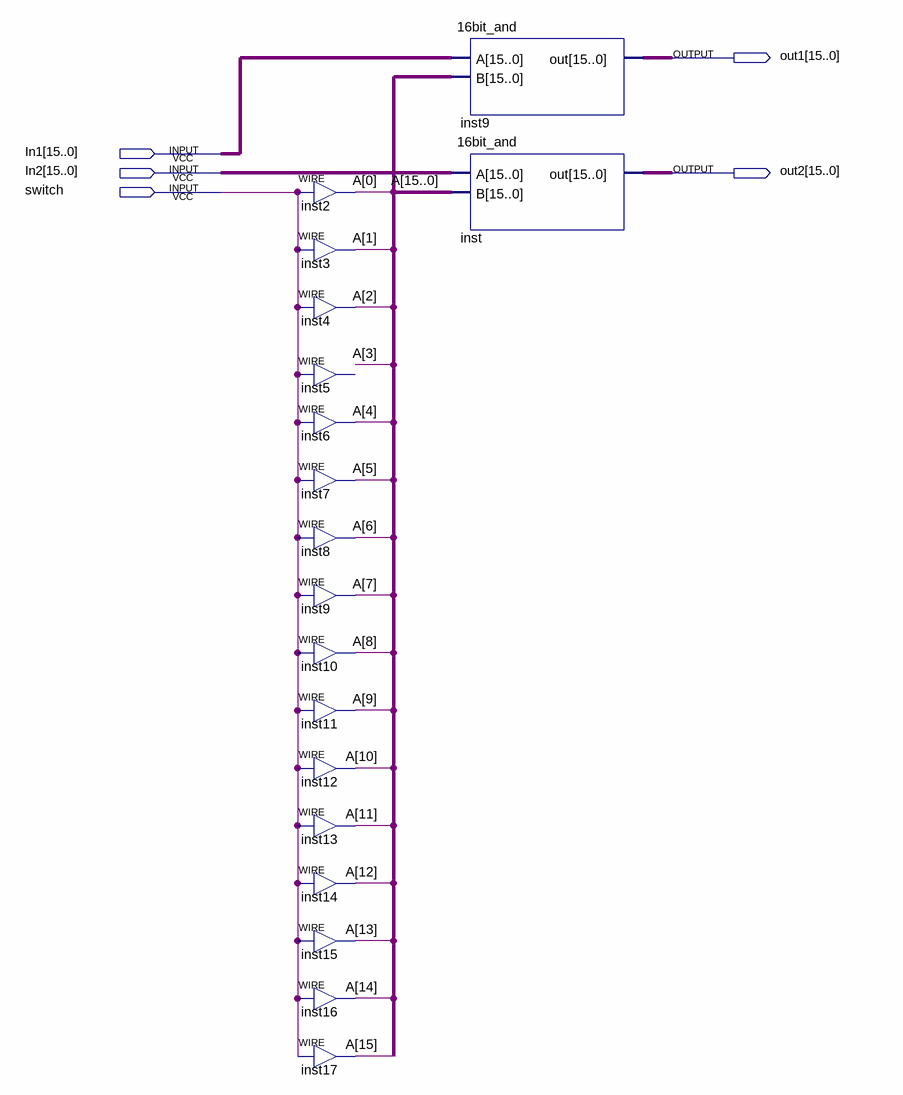
[diagram p0: schematic sheet]
// Quartus schematic celectgate.bdf as structural Verilog: 18 symbols, 5 pins
module celectgate (
  input  [15:0] In1,
  input  [15:0] In2,
  input  switch,
  output [15:0] out1,
  output [15:0] out2
);

  wire [15:0] A;

  assign A[0] = switch;  // WIRE inst2
  assign A[1] = switch;  // WIRE inst3
  assign A[2] = switch;  // WIRE inst4
  // WIRE inst5 has open pins
  assign A[4] = switch;  // WIRE inst6
  assign A[5] = switch;  // WIRE inst7
  assign A[6] = switch;  // WIRE inst8
  assign A[7] = switch;  // WIRE inst9
  assign A[8] = switch;  // WIRE inst10
  assign A[9] = switch;  // WIRE inst11
  assign A[10] = switch;  // WIRE inst12
  assign A[11] = switch;  // WIRE inst13
  assign A[12] = switch;  // WIRE inst14
  assign A[13] = switch;  // WIRE inst15
  assign A[14] = switch;  // WIRE inst16
  assign A[15] = switch;  // WIRE inst17
  \16bit_and  inst9_dup2 (.A(In1), .B(A), .out(out1));
  \16bit_and  inst (.A(In2), .B(A), .out(out2));
endmodule
